# Altium schematic sheet 13_USB30_USB20.SchDoc
size 386 x 246 mm
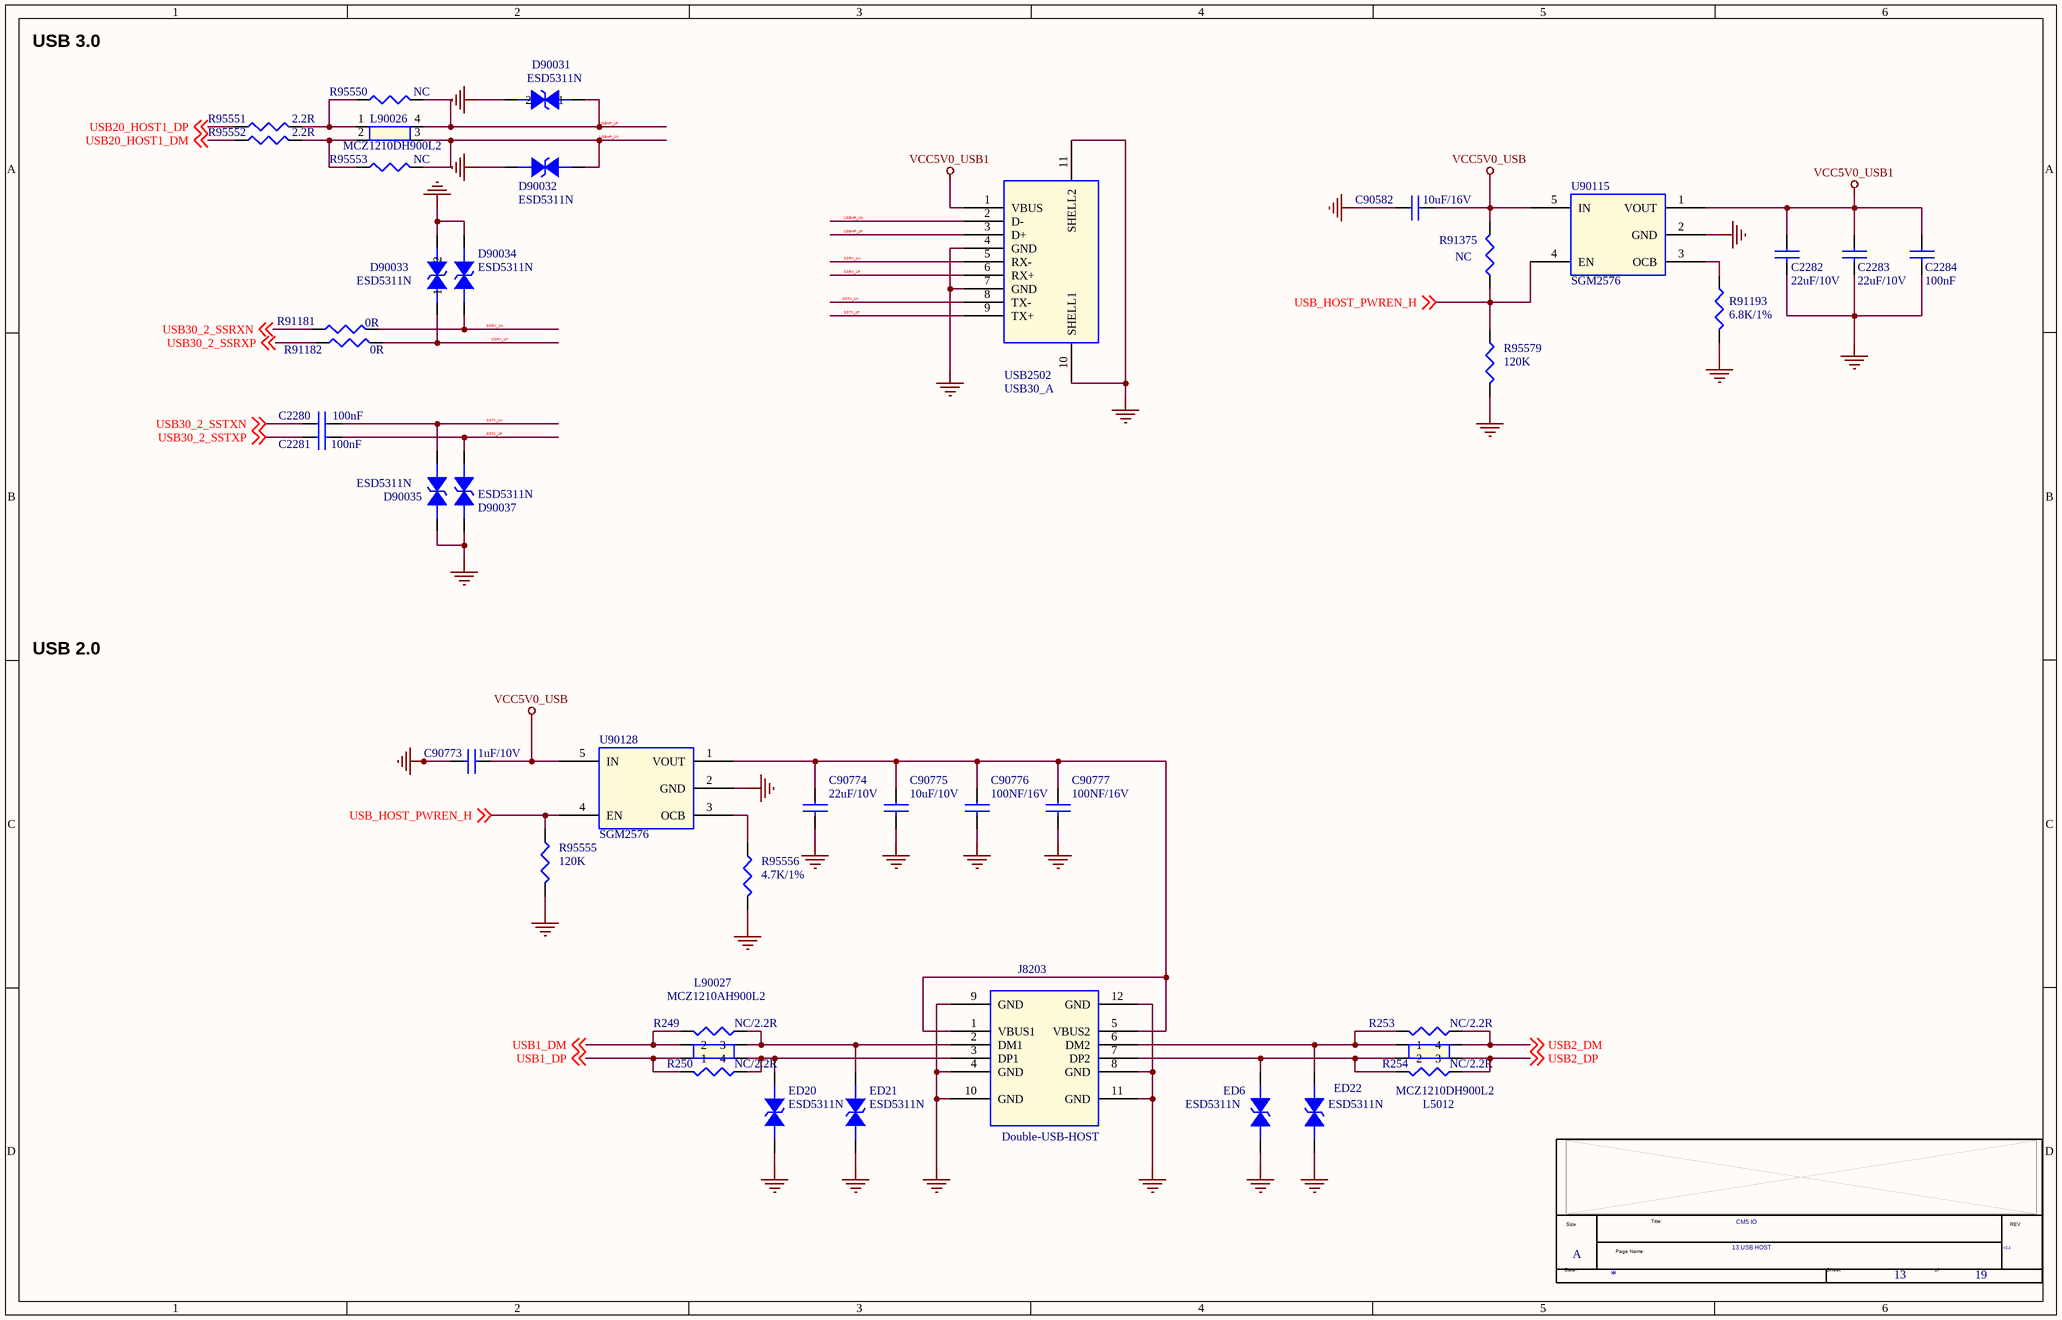
[diagram p0: 13_USB30_USB20.SchDoc]

## Parts
*  Doc: 13.USB HOST  RevCode: V2.2  Title: CM5 IO  Page Size: A  Page Number: 13  Page Count: 19  (hidden comment: radxa_1010)  (graphical)
C2280  100nF  [C0201]
C2281  100nF  [C0201]
C2282  22uF/10V  [C0603]
C2283  22uF/10V  [C0603]
C2284  100nF  [C0201]
C90582  10uF/16V  [C0402]
C90773  1uF/10V  [C0402]
C90774  22uF/10V  [C0603]
C90775  10uF/10V  [C0603]
C90776  100NF/16V  [C0402]
C90777  100NF/16V  [C0402]
D90031  ESD5311N  [ESD0402]
D90032  ESD5311N  [ESD0402]
D90033  ESD5311N  [ESD0402]
D90034  ESD5311N  [ESD0402]
D90035  ESD5311N  [ESD0402]
D90037  ESD5311N  [ESD0402]
ED6  ESD5311N  [ESD0402]
ED20  ESD5311N  [ESD0402]
ED21  ESD5311N  [ESD0402]
ED22  ESD5311N  [ESD0402]
J8203  Double-USB-HOST  [USB_DUAL]
L5012  MCZ1210DH900L2  [MCZ1210AH900L2]
L90026  MCZ1210DH900L2  [MCZ1210AH900L2]
L90027  MCZ1210AH900L2  [MCZ1210AH900L2]
R249  NC/2.2R  [R0402]
R250  NC/2.2R  [R0402]
R253  NC/2.2R  [R0402]
R254  NC/2.2R  [R0402]
R91181  0R  [R0402]
R91182  0R  [R0402]
R91193  6.8K/1%  [R0402]
R91375  NC  [R0402]
R95550  NC  [R0402]
R95551  2.2R  [R0402]
R95552  2.2R  [R0402]
R95553  NC  [R0402]
R95555  120K  [R0402]
R95556  4.7K/1%  [R0402]
R95579  120K  [R0402]
U90115  SGM2576  [SOT_23_5]
U90128  SGM2576  [SOT_23_5]
USB2502  USB30_A  [USB30]

## Nets
GND: C2282.2 C2283.2 C2284.2 C90582.1 C90773.2 C90774.2 C90775.2 C90776.2 C90777.2 D90031.2 D90032.2 D90033.2 D90034.2 D90035.2 D90037.2 ED6.2 ED20.2 ED21.2 ED22.2 J8203.4(GND) J8203.8(GND) J8203.9(GND) J8203.10(GND) J8203.11(GND) J8203.12(GND) R91193.2 R95555.2 R95556.2 R95579.2 U90115.2(GND) U90128.2(GND) USB2502.4(GND) USB2502.7(GND) USB2502.10(SHELL1) USB2502.11(SHELL2)
VCC5V0_USB: C90582.2 C90773.1 R91375.1 U90115.5(IN) U90128.5(IN)
VCC5V0_USB1: C2282.1 C2283.1 C2284.1 U90115.1(VOUT) USB2502.1(VBUS)
SSRX_1N: D90034.1 R91181.2 USB2502.5(RX-)
SSRX_1P: D90033.1 R91182.2 USB2502.6(RX+)
SSTX_1N: C2280.2 D90035.1 USB2502.8(TX-)
SSTX_1P: C2281.2 D90037.1 USB2502.9(TX+)
USB1_DM: L90027.2 R249.2 ; off-sheet USB1_DM
USB1_DP: L90027.1 R250.2 ; off-sheet USB1_DP
USB2_DM: L5012.4 R253.1 ; off-sheet USB2_DM
USB2_DP: L5012.3 R254.1 ; off-sheet USB2_DP
USB20_HOST1_DM: R95552.1 ; off-sheet USB20_HOST1_DM
USB20_HOST1_DP: R95551.1 ; off-sheet USB20_HOST1_DP
USB30_2_SSRXN: R91181.1 ; off-sheet USB30_2_SSRXN
USB30_2_SSRXP: R91182.1 ; off-sheet USB30_2_SSRXP
USB30_2_SSTXN: C2280.1 ; off-sheet USB30_2_SSTXN
USB30_2_SSTXP: C2281.1 ; off-sheet USB30_2_SSTXP
USB_HOST_PWREN_H: R91375.2 R95555.1 R95579.1 U90115.4(EN) U90128.4(EN) ; off-sheet USB_HOST_PWREN_H
USBHP_1N: D90032.1 L90026.3 R95553.2 USB2502.2(D-)
USBHP_1P: D90031.1 L90026.4 R95550.2 USB2502.3(D+)
NetC90774_1: C90774.1 C90775.1 C90776.1 C90777.1 J8203.1(VBUS1) J8203.5(VBUS2) U90128.1(VOUT)
NetED6_1: ED6.1 J8203.7(DP2) L5012.2 R254.2
NetED20_1: ED20.1 J8203.3(DP1) L90027.4 R250.1
NetED21_1: ED21.1 J8203.2(DM1) L90027.3 R249.1
NetED22_1: ED22.1 J8203.6(DM2) L5012.1 R253.2
NetL90026_1: L90026.1 R95550.1 R95551.2
NetL90026_2: L90026.2 R95552.2 R95553.1
NetR91193_1: R91193.1 U90115.3(OCB)
NetR95556_1: R95556.1 U90128.3(OCB)

## Notes on the sheet
- USB 3.0
- USB 2.0
- (in symbol radxa_1010) Size; Title:; REV; Page Name:; Date:; Sheet; of

## Library data of the parts
C2280 = CAP NP_0_Dup1: cap,100.00nF,+/-10%,10V,X5R,C0201; Manufacturer PN: C0603X5R1A104K030BC; Manufacturer: TDK; C_Voltage: 6.3V; Tolerance: 10%; Priority: A; Number: 37; Dielectric: X5R; PCB Footprint: C0201; Voltage: 10V; Created by: JJJ; Part Type: C0201; RK PN: C0603X5R1A104K030BC
C2281 = CAP NP_0_Dup1: cap,100.00nF,+/-10%,10V,X5R,C0201; Manufacturer: TDK; Number: 37; RK PN: C0603X5R1A104K030BC; Priority: A; Tolerance: 10%; C_Voltage: 6.3V; Dielectric: X5R; PCB Footprint: C0201; Voltage: 10V; Part Type: C0201; Manufacturer PN: C0603X5R1A104K030BC; Created by: JJJ
C2282 = CAP NP_0_Dup1: cap,100.00nF,+/-10%,10V,X5R,C0402; Manufacturer: TDK; RK PN: C1005X5R1A104K050BA; Priority: A; Tolerance: 10%; Dielectric: X5R; PCB Footprint: C0603; Voltage: 10V; Part Type: C0402; Manufacturer PN: C1005X5R1A104K050BA; Created by: JJJ
C2283 C2284 = CAP NP_0_Dup1: cap,100.00nF,+/-10%,10V,X5R,C0402; Manufacturer PN: C1005X5R1A104K050BA; Manufacturer: TDK; Tolerance: 10%; Priority: A; Dielectric: X5R; Voltage: 10V; Created by: JJJ; Part Type: C0402; RK PN: C1005X5R1A104K050BA
  C2283: PCB Footprint: C0603
  C2284: PCB Footprint: C0201
C90582 = C / 10 / uF / 0402_0: 0402 ∮20% 10uF X5R 6.3V; FunctionGroup: Petrus / PMIC; Vendor: Murata; Vendor_PN: GRM155R60J106ME05; FS: Y; PCB Footprint: C0603; Property1: ∮20%; Property2: X5R; Property3: 6.3V; EBOM: C / 10 / uF / 0402
C90773 = CAP NP_0_Dup2: cap,1.00uF,+/-10%,10V,X5R,C0402; Manufacturer PN: C1005X5R1A105K050BB; Manufacturer: TDK; Tolerance: 10%; C_Voltage: 6.3V; Priority: A; Voltage: 10V; PCB Footprint: C0402; Dielectric: X5R; Created by: JJJ; Part Type: C0402; RK PN: C1005X5R1A105K050BB
C90774 = CAP NP_0_Dup2: cap,22.00uF,+/-20%,10V,X5R,C0603; Manufacturer PN: C1608X5R1A226M080AC; Manufacturer: TDK; Tolerance: 20%; Priority: A; Voltage: 10V; PCB Footprint: C0603; Dielectric: X5R; Created by: JJJ; Part Type: C0603; RK PN: C1608X5R1A226M080AC
C90775 = CAP NP_0_Dup2: cap,10.00uF,+/-10%,10V,X5R,C0603; Manufacturer: TDK; RK PN: C1608X5R1A106K080AC; Priority: A; Tolerance: 10%; Voltage: 10V; PCB Footprint: C0603; Dielectric: X5R; Part Type: C0603; Manufacturer PN: C1608X5R1A106K080AC; Created by: JJJ
C90776 C90777 = CAP NP_0_Dup2: cap,100.00nF,+/-10%,16V,X5R,C0402; Manufacturer: TDK; RK PN: C1005X5R1C104K050BA; Priority: A; Tolerance: 10%; Voltage: 16V; PCB Footprint: C0402; Dielectric: X5R; Part Type: C0402; Manufacturer PN: C1005X5R1C104K050BA; Created by: JJJ
D90031 = DIODE BI_DIR TRIG_0: 1-Line, Bi-directional, Transient Voltage Suppressors.1pF.; Manufacturer: WillSemi(韦尔半导体); Manufacturer PN: ESD5341N; Priority: A; PCB Footprint: ESD0402; Created by: JJJ; Part Type: ESD_TVS; RK PN: ESD5341N
D90032 D90034 ED22 = DIODE BI_DIR TRIG_1_Dup1: 1-Line, Bi-directional, Transient Voltage Suppressors.1pF.; Manufacturer: WillSemi(韦尔半导体); Manufacturer PN: ESD5341N; Priority: A; PCB Footprint: ESD0402; Created by: JJJ; Part Type: ESD_TVS; RK PN: ESD5341N
D90033 = DIODE BI_DIR TRIG_1: 1-Line, Bi-directional, Transient Voltage Suppressors.1pF.; Manufacturer: WillSemi(韦尔半导体); Manufacturer PN: ESD5341N; Priority: A; PCB Footprint: ESD0402; Created by: JJJ; Part Type: ESD_TVS; RK PN: ESD5341N
D90035 D90037 ED6 ED20 ED21 = DIODE BI_DIR TRIG_1_Dup1: 1-Line, Bi-directional, Transient Voltage Suppressors.1pF.; Manufacturer: WillSemi(韦尔半导体); RK PN: ESD5341N; Priority: A; PCB Footprint: ESD0402; Part Type: ESD_TVS; Manufacturer PN: ESD5341N; Created by: JJJ
J8203 = Double-USB: PCB Footprint: USB_DUAL
L5012 L90027 = MCZ1210AH900L2_3: PCB Footprint: MCZ1210AH900L2
L90026 = MCZ1210AH900L2_1_Dup1: PCB Footprint: MCZ1210AH900L2
R249 R250 R253 R254 = RESISTOR_1_Dup1: 通用厚膜电阻,2R2,+/-5%,R0402,1/16W.; Manufacturer: YAGEO; Tolerance: 5%; RK PN: RC0402JR-072R2L; Priority: A; Wattage: 1/16W; PCB Footprint: R0402; Part Type: 通用厚膜电阻; Manufacturer PN: RC0402JR-072R2L; Created by: YTL
R91181 = RESISTOR_0_Dup1: 通用厚膜电阻,0R,+/-5%,R0201,1/20W.; Manufacturer PN: RC0201JR-070RL; Manufacturer: YAGEO; Tolerance: 5%; Wattage: 1/20W; Priority: A; PCB Footprint: R0201; Created by: YTL; Part Type: 通用厚膜电阻; RK PN: RC0201JR-070RL
R91182 = RESISTOR_0_Dup1: 通用厚膜电阻,0R,+/-5%,R0201,1/20W.; Manufacturer: YAGEO; Tolerance: 5%; RK PN: RC0201JR-070RL; Priority: A; Wattage: 1/20W; PCB Footprint: R0201; Part Type: 通用厚膜电阻; Manufacturer PN: RC0201JR-070RL; Created by: YTL
R91193 = RESISTOR_0_Dup1: 通用厚膜电阻,4K7,+/-5%,R0402,1/16W.; Manufacturer: YAGEO; Tolerance: 1%; PCB Footprint: R0201; RK PN: RC0402JR-074K7L; Priority: A; Wattage: 1/16W; Part Type: 通用厚膜电阻; Manufacturer PN: RC0402JR-074K7L; Created by: YTL
R91375 = RESISTOR_0_Dup1: Did Not Place.; Manufacturer PN: DNP0402; Tolerance: 0%; PCB Footprint: R0201; Priority: A; Created by: JJJ; Part Type: DNP; RK PN: DNP0402
R95550 R95552 R95553 = RESISTOR_0_Dup1: 通用厚膜电阻,2R2,+/-5%,R0402,1/16W.; Manufacturer PN: RC0402JR-072R2L; Manufacturer: YAGEO; Tolerance: 5%; Wattage: 1/16W; Priority: A; PCB Footprint: R0402; Created by: YTL; Part Type: 通用厚膜电阻; RK PN: RC0402JR-072R2L
R95551 = RESISTOR_0_Dup1: 通用厚膜电阻,2R2,+/-5%,R0402,1/16W.; Manufacturer: YAGEO; Tolerance: 5%; RK PN: RC0402JR-072R2L; Priority: A; Wattage: 1/16W; PCB Footprint: R0402; Part Type: 通用厚膜电阻; Manufacturer PN: RC0402JR-072R2L; Created by: YTL
R95555 R95579 = RESISTOR_1_Dup1: 通用厚膜电阻,100K,+/-5%,R0402,1/16W.; Manufacturer PN: RC0402JR-07100KL; Manufacturer: YAGEO; PCB Footprint: R0201; Tolerance: 5%; Wattage: 1/16W; Priority: A; Created by: YTL; Part Type: 通用厚膜电阻; RK PN: RC0402JR-07100KL
R95556 = RESISTOR_1_Dup1: 通用厚膜电阻,10K,+/-1%,R0402,1/16W.; Manufacturer PN: RC0402FR-0710KL; Manufacturer: YAGEO; PCB Footprint: R0201; Tolerance: 1%; Wattage: 1/16W; Priority: A; Created by: YTL; Part Type: 通用厚膜电阻; RK PN: RC0402FR-0710KL
U90115 U90128 = SWITCH_SY6280: Low Loss Power Distribution Switch; Manufacturer: Silergy（矽力杰）; RK PN: SY6280AAC; Priority: A; PCB Footprint: SOT_23_5; Part Type: Switch; Manufacturer PN: SY6280AAC; Created by: JJJ
USB2502 = USB30_TYPE_A: A型USB3.0座，卧式，插焊; Manufacturer: 旺科达; PCB Footprint: USB30-L1; RK PN: USB-HOST_30; Priority: A; Part Type: USB Jack; Manufacturer Part Number: USB30_A; Created by: JJJ
* = radxa_1010: Page Create Date: March  8, 1995; Page Modify Date: *